# Altium schematic sheet RGB_FPGA_Misc.SchDoc
size A4
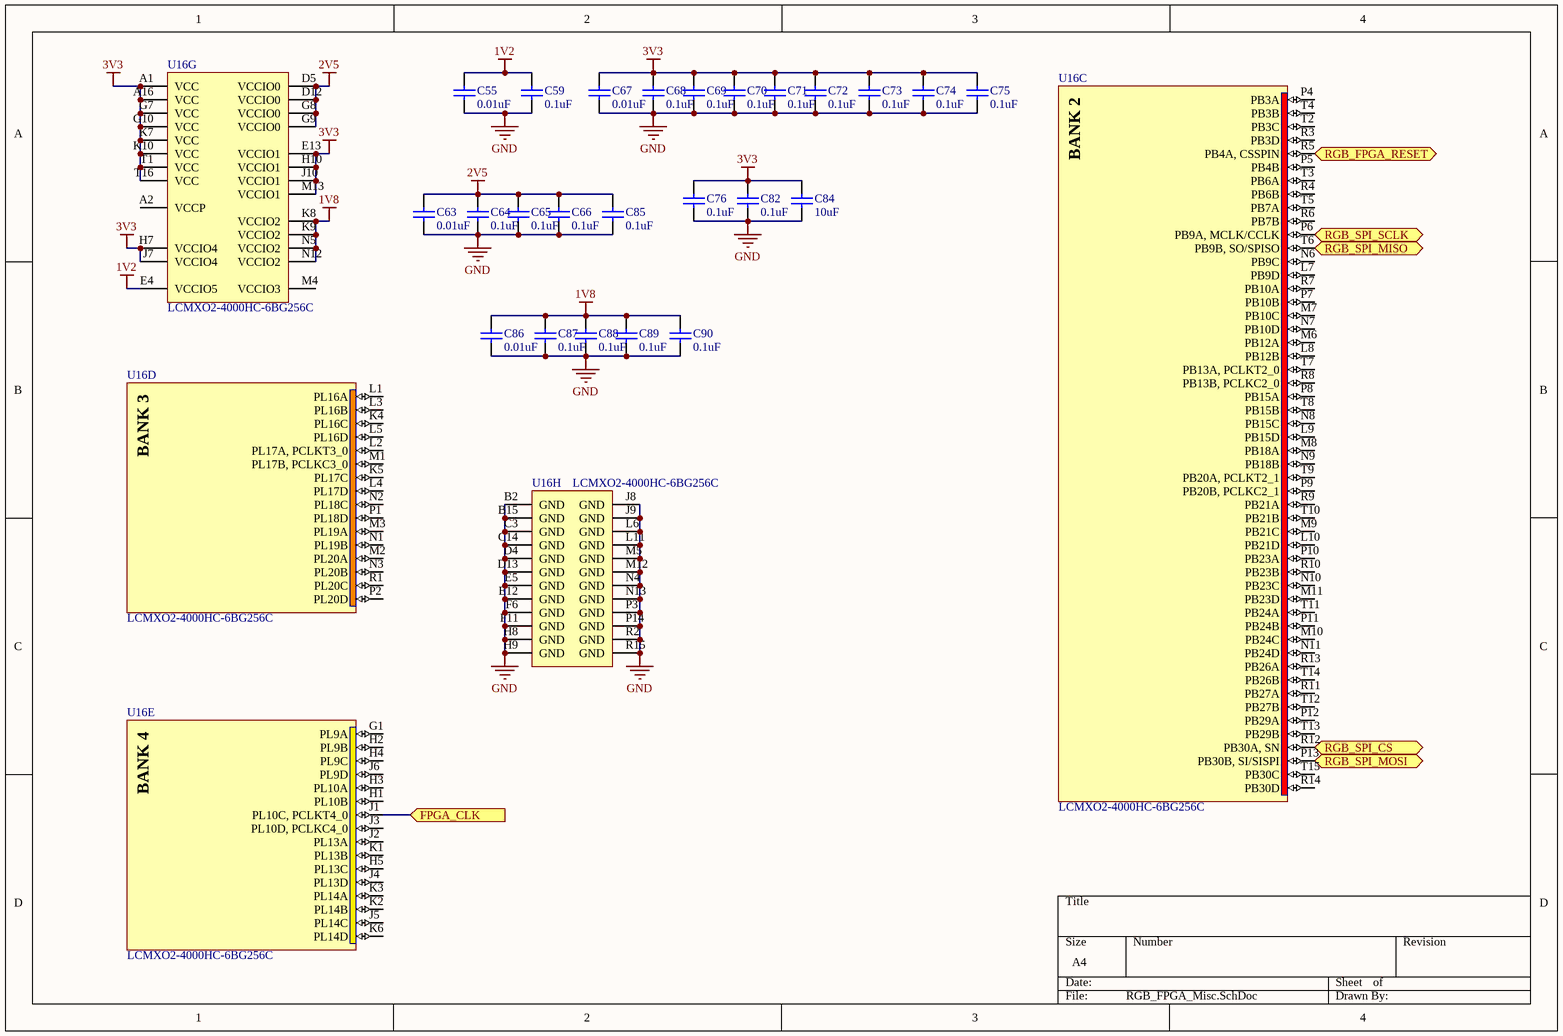
[diagram p0: RGB_FPGA_Misc.SchDoc]

## Parts
C55  value 0.01uF  [0402C_M]  (hidden comment: GRM155R71H103KA88D)
C59  Capacitance: 0.1uF  [0402C_M]  (hidden comment: GRM155R71C104KA88D)
C63  value 0.01uF  [0402C_M]  (hidden comment: GRM155R71H103KA88D)
C64  Capacitance: 0.1uF  [0402C_M]  (hidden comment: GRM155R71C104KA88D)
C65  Capacitance: 0.1uF  [0402C_M]  (hidden comment: GRM155R71C104KA88D)
C66  Capacitance: 0.1uF  [0402C_M]  (hidden comment: GRM155R71C104KA88D)
C67  value 0.01uF  [0402C_M]  (hidden comment: GRM155R71H103KA88D)
C68  Capacitance: 0.1uF  [0402C_M]  (hidden comment: GRM155R71C104KA88D)
C69  Capacitance: 0.1uF  [0402C_M]  (hidden comment: GRM155R71C104KA88D)
C70  Capacitance: 0.1uF  [0402C_M]  (hidden comment: GRM155R71C104KA88D)
C71  Capacitance: 0.1uF  [0402C_M]  (hidden comment: GRM155R71C104KA88D)
C72  Capacitance: 0.1uF  [0402C_M]  (hidden comment: GRM155R71C104KA88D)
C73  Capacitance: 0.1uF  [0402C_M]  (hidden comment: GRM155R71C104KA88D)
C74  Capacitance: 0.1uF  [0402C_M]  (hidden comment: GRM155R71C104KA88D)
C75  Capacitance: 0.1uF  [0402C_M]  (hidden comment: GRM155R71C104KA88D)
C76  Capacitance: 0.1uF  [0402C_M]  (hidden comment: GRM155R71C104KA88D)
C82  Capacitance: 0.1uF  [0402C_M]  (hidden comment: GRM155R71C104KA88D)
C84  value 10uF  [0603C_M]  (hidden comment: GRM188R60J106ME47D)
C85  Capacitance: 0.1uF  [0402C_M]  (hidden comment: GRM155R71C104KA88D)
C86  value 0.01uF  [0402C_M]  (hidden comment: GRM155R71H103KA88D)
C87  Capacitance: 0.1uF  [0402C_M]  (hidden comment: GRM155R71C104KA88D)
C88  Capacitance: 0.1uF  [0402C_M]  (hidden comment: GRM155R71C104KA88D)
C89  Capacitance: 0.1uF  [0402C_M]  (hidden comment: GRM155R71C104KA88D)
C90  Capacitance: 0.1uF  [0402C_M]  (hidden comment: GRM155R71C104KA88D)
U16  LCMXO2-4000HC-6BG256C  [caBGA256]  (parts C,D,E,G,H of 8)

## Ports
FPGA_CLK (in), RGB_FPGA_RESET (in), RGB_SPI_CS (in), RGB_SPI_MISO (out), RGB_SPI_MOSI (in), RGB_SPI_SCLK (in)

## Nets
1V2: C55.2 C59.2 U16.E4(VCCIO5)
1V8: C86.2 C87.2 C88.2 C89.2 C90.2 U16.K8(VCCIO2) U16.K9(VCCIO2) U16.N5(VCCIO2) U16.N12(VCCIO2)
2V5: C63.2 C64.2 C65.2 C66.2 C85.2 U16.D5(VCCIO0) U16.D12(VCCIO0) U16.G8(VCCIO0) U16.G9(VCCIO0)
3V3: C67.2 C68.2 C69.2 C70.2 C71.2 C72.2 C73.2 C74.2 C75.2 C76.2 C82.2 C84.2 U16.A1(VCC) U16.A16(VCC) U16.E13(VCCIO1) U16.G7(VCC) U16.G10(VCC) U16.H7(VCCIO4) U16.H10(VCCIO1) U16.J7(VCCIO4) U16.J10(VCCIO1) U16.K7(VCC) U16.K10(VCC) U16.M13(VCCIO1) U16.T1(VCC) U16.T16(VCC)
GND: C55.1 C59.1 C63.1 C64.1 C65.1 C66.1 C67.1 C68.1 C69.1 C70.1 C71.1 C72.1 C73.1 C74.1 C75.1 C76.1 C82.1 C84.1 C85.1 C86.1 C87.1 C88.1 C89.1 C90.1 U16.B2(GND) U16.B15(GND) U16.C3(GND) U16.C14(GND) U16.D4(GND) U16.D13(GND) U16.E5(GND) U16.E12(GND) U16.F6(GND) U16.F11(GND) U16.H8(GND) U16.H9(GND) U16.J8(GND) U16.J9(GND) U16.L6(GND) U16.L11(GND) U16.M5(GND) U16.M12(GND) U16.N4(GND) U16.N13(GND) U16.P3(GND) U16.P14(GND) U16.R2(GND) U16.R15(GND)
FPGA_CLK: U16.J1(PL10C,_PCLKT4_0) ; port FPGA_CLK
RGB_FPGA_RESET: U16.R5(PB4A,_CSSPIN) ; port RGB_FPGA_RESET
RGB_SPI_CS: U16.R12(PB30A,_SN) ; port RGB_SPI_CS
RGB_SPI_MISO: U16.T6(PB9B,_SO/SPISO) ; port RGB_SPI_MISO
RGB_SPI_MOSI: U16.P13(PB30B,_SI/SISPI) ; port RGB_SPI_MOSI
RGB_SPI_SCLK: U16.P6(PB9A,_MCLK/CCLK) ; port RGB_SPI_SCLK

Not connected (* = marked no-connect by the designer): U16 A2(VCCP) G1(PL9A) H1(PL10B) H2(PL9B) H3(PL10A) H4(PL9C) H5(PL13C) J2(PL13A) J3(PL10D,_PCLKC4_0) J4(PL13D) J5(PL14C) J6(PL9D) K1(PL13B) K2(PL14B) K3(PL14A) K4(PL16C) K5(PL17C) K6(PL14D) L1(PL16A) L2(PL17A,_PCLKT3_0) L3(PL16B) L4(PL17D) L5(PL16D) L7(PB9D) L8(PB12B) L9(PB15D) L10(PB21D) M1(PL17B,_PCLKC3_0) M2(PL20A) M3(PL19A) M4(VCCIO3) M6(PB12A) M7(PB10C) M8(PB18A) M9(PB21C) M10(PB24C) M11(PB23D) N1(PL19B) N2(PL18C) N3(PL20B) N6(PB9C) N7(PB10D) N8(PB15C) N9(PB18B) N10(PB23C) N11(PB24D) P1(PL18D) P2(PL20D) P4(PB3A) P5(PB4B) P7(PB10B) P8(PB15A) P9(PB20B,_PCLKC2_1) P10(PB23A) P11(PB24B) P12(PB29A) R1(PL20C) R3(PB3D) R4(PB6B) R6(PB7B) R7(PB10A) R8(PB13B,_PCLKC2_0) R9(PB21A) R10(PB23B) R11(PB27A) R13(PB26A) R14(PB30D) T2(PB3C) T3(PB6A) T4(PB3B) T5(PB7A) T7(PB13A,_PCLKT2_0) T8(PB15B) T9(PB20A,_PCLKT2_1) T10(PB21B) T11(PB24A) T12(PB27B) T13(PB29B) T14(PB26B) T15(PB30C)

## Notes on the sheet
- (in symbol CMP-0111-00181-1, part C) BANK 2
- (in symbol CMP-0111-00181-1, part D) BANK 3
- (in symbol CMP-0111-00181-1, part E) BANK 4

## Library data of the parts
C55 C63 C67 C86 = GRM155R71H103KA88D: CAP CER 0.01uF 50V X7R 0402; Manufacturer: Murata Electronics North America; Tolerance: ±10%; Supplier 1: Digi-Key; Manufacturer Part Number: GRM155R71H103KA88D; RoHS: RoHS Compliant; Category: Capacitors; Stock 1: 10436079; Pricing 1: 1=0.1, 10=0.011, 100=0.005, 500=0.00354, 1000=0.00278, 2500=0.00253, 5000=0.00233 (USD); Packaging: Cut Tape (CT); Part Status: Active; Voltage - Rated: 50V; Temperature Coefficient: X7R; Operating Temperature: -55°C ~ 125°C; Features: -; Ratings: -; Applications: General Purpose; Mounting Type: Surface Mount, MLCC; Package / Case: 0402 (1005 Metric); Size / Dimension: 0.039" L x 0.020" W (1.00mm x 0.50mm); Height - Seated (Max): -; Thickness (Max): 0.022" (0.55mm); Lead Spacing: -; Lead Style: -; ComponentLink1URL: http://www.murata.com/~/media/webrenewal/support/library/catalog/products/capacitor/mlcc/c02e.pdf; ComponentLink1Description: http://www.murata.com/~/media/webrenewal/support/library/catalog/products/capacitor/mlcc/c02e.pdf; Supplier Part Number 1: 490-4516-1-ND
C59 C64-C66 C68-C76 C82 C85 C87-C90 = GRM155R71C104KA88D: CAP CER 0.1UF 16V X7R 0402; Manufacturer: Murata Electronics North America; Tolerance: ±10%; Supplier 1: Digi-Key; Manufacturer Part Number: GRM155R71C104KA88D; RoHS: RoHS Compliant; Category: Capacitors; Stock 1: 58190082; Pricing 1: 1=0.1, 10=0.013, 100=0.0059, 500=0.00422, 1000=0.00332, 2500=0.00302, 5000=0.00278 (USD); Packaging: Cut Tape (CT); Part Status: Active; Voltage - Rated: 16V; Temperature Coefficient: X7R; Operating Temperature: -55°C ~ 125°C; Features: -; Ratings: -; Applications: General Purpose; Mounting Type: Surface Mount, MLCC; Package / Case: 0402 (1005 Metric); Size / Dimension: 0.039" L x 0.020" W (1.00mm x 0.50mm); Height - Seated (Max): -; Thickness (Max): 0.022" (0.55mm); Lead Spacing: -; Lead Style: -; ComponentLink1URL: http://www.murata.com/~/media/webrenewal/support/library/catalog/products/capacitor/mlcc/c02e.ashx; ComponentLink1Description: http://www.murata.com/~/media/webrenewal/support/library/catalog/products/capacitor/mlcc/c02e.ashx; Supplier Part Number 1: 490-3261-1-ND
C84 = GRM188R60J106ME47D: CAP CER 10UF 6.3V X5R 0603; Manufacturer: Murata Electronics North America; Tolerance: ±20%; Supplier 1: Digi-Key; Manufacturer Part Number: GRM188R60J106ME47D; RoHS: RoHS Compliant; Category: Capacitors; Stock 1: 13697850; Pricing 1: 1=0.17, 10=0.123, 100=0.0578, 500=0.04052, 1000=0.03355 (USD); Packaging: Cut Tape (CT); Part Status: Active; Voltage - Rated: 6.3V; Temperature Coefficient: X5R; Operating Temperature: -55°C ~ 85°C; Features: -; Ratings: -; Applications: General Purpose; Mounting Type: Surface Mount, MLCC; Package / Case: 0603 (1608 Metric); Size / Dimension: 0.063" L x 0.031" W (1.60mm x 0.80mm); Height - Seated (Max): -; Thickness (Max): 0.035" (0.90mm); Lead Spacing: -; Lead Style: -; ComponentLink1URL: http://www.murata.com/~/media/webrenewal/support/library/catalog/products/capacitor/mlcc/c02e.pdf; ComponentLink1Description: http://www.murata.com/~/media/webrenewal/support/library/catalog/products/capacitor/mlcc/c02e.pdf; Supplier Part Number 1: 490-3896-1-ND
U16 = CMP-0111-00181-1: MachXO2 High Performance CPLD with 4320 LUTs, Voltage Regulator, 2.5V/3.3V, 256-pin caBGA, Speed Grade-6, Commercial Grade, Halogen Free (RoHS); PackageDescription: 256-Ball caBGA Package, 14 x 14 mm Body, 0.8 mm Pitch; DatasheetVersion: ver01.0, Nov-2010; PackageReference: caBGA256; PackageVersion: ver02.6, Nov-2010; Code_JEDEC: MO-275-JJAB-2; PartId: 1